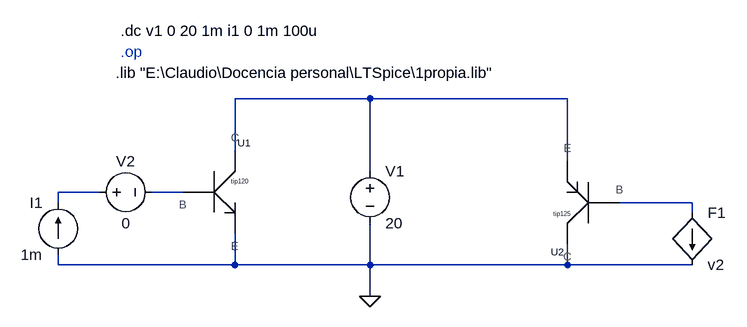
[diagram p0: schematic tip120 tip125.asc]
tip120 tip125.asc, the LTspice schematic file:
Version 4
SHEET 1 1288 680
WIRE 736 48 528 48
WIRE 1040 48 736 48
WIRE 528 128 528 48
WIRE 1040 144 1040 48
WIRE 736 160 736 48
WIRE 320 192 256 192
WIRE 448 192 400 192
WIRE 256 208 256 192
WIRE 1232 208 1120 208
WIRE 1232 224 1232 208
WIRE 256 304 256 288
WIRE 528 304 528 256
WIRE 528 304 256 304
WIRE 736 304 736 240
WIRE 736 304 528 304
WIRE 1040 304 1040 272
WIRE 1040 304 736 304
WIRE 1232 304 1040 304
WIRE 736 352 736 304
FLAG 736 352 0
SYMBOL Propia\\Darlington\ npn 496 192 R0
SYMATTR Value tip120
SYMATTR InstName U1
SYMBOL voltage 736 144 R0
WINDOW 123 0 0 Left 0
WINDOW 39 0 0 Left 0
SYMATTR InstName V1
SYMATTR Value 20
SYMBOL current 256 288 R180
WINDOW 0 24 80 Left 2
WINDOW 3 24 0 Left 2
WINDOW 123 0 0 Left 0
WINDOW 39 0 0 Left 0
SYMATTR InstName I1
SYMATTR Value 1m
SYMBOL voltage 304 192 R270
WINDOW 0 32 56 VTop 2
WINDOW 3 -32 56 VBottom 2
WINDOW 123 0 0 Left 0
WINDOW 39 0 0 Left 0
SYMATTR InstName V2
SYMATTR Value 0
SYMBOL f 1232 224 R0
SYMATTR InstName F1
SYMATTR Value v2
SYMATTR Value2 1
SYMBOL Propia\\Darlington\ pnp 1072 208 R180
SYMATTR Value tip125
SYMATTR InstName U2
TEXT 344 8 Left 2 !.lib "E:\\Claudio\\Docencia personal\\LTSpice\\1propia.lib"
TEXT 352 -24 Left 2 ;.op
TEXT 352 -56 Left 2 !.dc v1 0 20 1m i1 0 1m 100u

The netlist it stands for:
* tip120 tip125.asc
XU1 N001 N003 0 tip120  ; pins C B E
V1 N001 0 20
I1 0 N002 1m
V2 N002 N003 0
F1 N004 0 v2 1
XU2 0 N004 N001 tip125  ; pins C B E
.lib "E:\Claudio\Docencia personal\LTSpice\1propia.lib"
* .op
.dc v1 0 20 1m i1 0 1m 100u
.backanno
.end